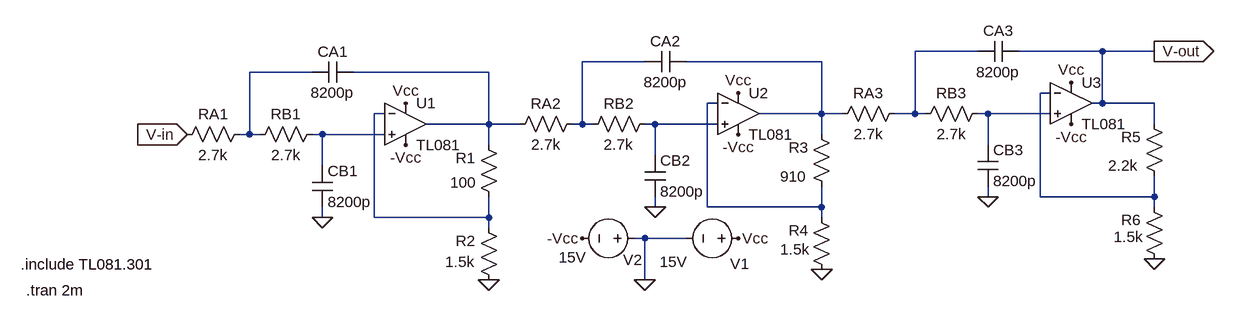
[diagram p0: schematic activefilter.asc]
activefilter.asc, the LTspice schematic file:
Version 4
SHEET 1 1476 912
WIRE 1072 32 976 32
WIRE 1264 32 1136 32
WIRE 1344 32 1264 32
WIRE 560 48 464 48
WIRE 832 48 624 48
WIRE 48 64 -48 64
WIRE 320 64 112 64
WIRE 1184 96 1168 96
WIRE 672 112 656 112
WIRE 1264 112 1264 32
WIRE 1264 112 1248 112
WIRE 1344 112 1264 112
WIRE 160 128 144 128
WIRE 832 128 832 48
WIRE 832 128 736 128
WIRE 864 128 832 128
WIRE 976 128 976 32
WIRE 976 128 944 128
WIRE 992 128 976 128
WIRE 1088 128 1072 128
WIRE 1184 128 1088 128
WIRE 320 144 320 64
WIRE 320 144 224 144
WIRE 368 144 320 144
WIRE 464 144 464 48
WIRE 464 144 448 144
WIRE 480 144 464 144
WIRE 576 144 560 144
WIRE 672 144 576 144
WIRE 1344 144 1344 112
WIRE -48 160 -48 64
WIRE -48 160 -64 160
WIRE -32 160 -48 160
WIRE 64 160 48 160
WIRE 160 160 64 160
WIRE 832 160 832 128
WIRE 320 176 320 144
WIRE 1088 176 1088 128
WIRE 576 192 576 144
WIRE 64 208 64 160
WIRE 1088 256 1088 240
WIRE 1168 256 1168 96
WIRE 1344 256 1344 224
WIRE 1344 256 1168 256
WIRE 576 272 576 256
WIRE 656 272 656 112
WIRE 832 272 832 240
WIRE 832 272 656 272
WIRE 1344 272 1344 256
WIRE 64 288 64 272
WIRE 144 288 144 128
WIRE 320 288 320 256
WIRE 320 288 144 288
WIRE 832 288 832 272
WIRE 320 304 320 288
WIRE 560 320 544 320
WIRE 624 320 560 320
WIRE 560 384 560 320
FLAG 320 384 0
FLAG 64 288 0
FLAG 704 320 Vcc
FLAG 464 320 -Vcc
FLAG 192 176 -Vcc
FLAG 832 368 0
FLAG 576 272 0
FLAG 704 160 -Vcc
FLAG 1344 352 0
FLAG 1088 256 0
FLAG 1216 144 -Vcc
FLAG 192 112 Vcc
FLAG 704 96 Vcc
FLAG 1216 80 Vcc
FLAG 560 384 0
FLAG 1344 32 V-out
IOPIN 1344 32 Out
FLAG -144 160 V-in
IOPIN -144 160 In
SYMBOL voltage 720 320 R90
WINDOW 123 0 0 Left 0
WINDOW 39 0 0 Left 0
WINDOW 0 39 -1 VRight 2
WINDOW 3 36 94 VRight 2
SYMATTR InstName V1
SYMATTR Value 15V
SYMBOL voltage 560 320 R90
WINDOW 123 0 0 Left 0
WINDOW 39 0 0 Left 0
WINDOW 0 33 4 VRight 2
WINDOW 3 29 90 VRight 2
SYMATTR InstName V2
SYMATTR Value 15V
SYMBOL res 64 144 R90
WINDOW 0 0 56 VBottom 2
WINDOW 3 32 56 VTop 2
SYMATTR InstName RB1
SYMATTR Value 2.7k
SYMBOL res -48 144 R90
WINDOW 0 0 56 VBottom 2
WINDOW 3 32 56 VTop 2
SYMATTR InstName RA1
SYMATTR Value 2.7k
SYMBOL res 336 272 R180
WINDOW 0 36 76 Left 2
WINDOW 3 35 38 Left 2
SYMATTR InstName R1
SYMATTR Value 100
SYMBOL res 336 400 R180
WINDOW 0 36 76 Left 2
WINDOW 3 37 44 Left 2
SYMATTR InstName R2
SYMATTR Value 1.5k
SYMBOL cap 48 208 R0
SYMATTR InstName CB1
SYMATTR Value 8200p
SYMBOL cap 112 48 R90
WINDOW 0 0 32 VBottom 2
WINDOW 3 32 32 VTop 2
SYMATTR InstName CA1
SYMATTR Value 8200p
SYMBOL res 576 128 R90
WINDOW 0 0 56 VBottom 2
WINDOW 3 32 56 VTop 2
SYMATTR InstName RB2
SYMATTR Value 2.7k
SYMBOL res 464 128 R90
WINDOW 0 0 56 VBottom 2
WINDOW 3 32 56 VTop 2
SYMATTR InstName RA2
SYMATTR Value 2.7k
SYMBOL res 848 256 R180
WINDOW 0 36 76 Left 2
WINDOW 3 39 31 Left 2
SYMATTR InstName R3
SYMATTR Value 910
SYMBOL res 848 384 R180
WINDOW 0 36 76 Left 2
WINDOW 3 34 47 Left 2
SYMATTR InstName R4
SYMATTR Value 1.5k
SYMBOL cap 560 192 R0
SYMATTR InstName CB2
SYMATTR Value 8200p
SYMBOL cap 624 32 R90
WINDOW 0 0 32 VBottom 2
WINDOW 3 32 32 VTop 2
SYMATTR InstName CA2
SYMATTR Value 8200p
SYMBOL res 1088 112 R90
WINDOW 0 0 56 VBottom 2
WINDOW 3 32 56 VTop 2
SYMATTR InstName RB3
SYMATTR Value 2.7k
SYMBOL res 1360 240 R180
WINDOW 0 36 76 Left 2
WINDOW 3 41 32 Left 2
SYMATTR InstName R5
SYMATTR Value 2.2k
SYMBOL res 1360 368 R180
WINDOW 0 36 76 Left 2
WINDOW 3 33 50 Left 2
SYMATTR InstName R6
SYMATTR Value 1.5k
SYMBOL cap 1072 176 R0
SYMATTR InstName CB3
SYMATTR Value 8200p
SYMBOL cap 1136 16 R90
WINDOW 0 0 32 VBottom 2
WINDOW 3 32 32 VTop 2
SYMATTR InstName CA3
SYMATTR Value 8200p
SYMBOL res 960 112 R90
WINDOW 0 0 56 VBottom 2
WINDOW 3 32 56 VTop 2
SYMATTR InstName RA3
SYMATTR Value 2.7k
SYMBOL OpAmps\\opamp2 192 80 R0
SYMATTR InstName U1
SYMATTR Value TL081
SYMBOL OpAmps\\opamp2 704 64 R0
SYMATTR InstName U2
SYMATTR Value TL081
SYMBOL OpAmps\\opamp2 1216 48 R0
SYMATTR InstName U3
SYMATTR Value TL081
TEXT -392 400 Left 2 !.tran 2m
TEXT -400 360 Left 2 !.include TL081.301

The netlist it stands for:
* activefilter.asc
V1 Vcc 0 15V
V2 0 -Vcc 15V
RB1 N011 N004 2.7k
RA1 N004 V-in 2.7k
R1 N008 N005 100
R2 0 N008 1.5k
CB1 N011 0 8200p
CA1 N005 N004 8200p
RB2 N010 N002 2.7k
RA2 N002 N005 2.7k
R3 N007 N003 910
R4 0 N007 1.5k
CB2 N010 0 8200p
CA2 N003 N002 8200p
RB3 N009 N001 2.7k
R5 N006 V-out 2.2k
R6 0 N006 1.5k
CB3 N009 0 8200p
CA3 V-out N001 8200p
RA3 N001 N003 2.7k
XU1 N011 N008 Vcc -Vcc N005 TL081  ; pins In+ In- V+ V- OUT
XU2 N010 N007 Vcc -Vcc N003 TL081  ; pins In+ In- V+ V- OUT
XU3 N009 N006 Vcc -Vcc V-out TL081  ; pins In+ In- V+ V- OUT
.tran 2m
.include TL081.301
.backanno
.end